# Altium schematic sheet MCU.SchDoc: SMART_HOME
size A3; DrawnBy: Le Viet Trong; SheetNumber: 4; SheetTotal: 5
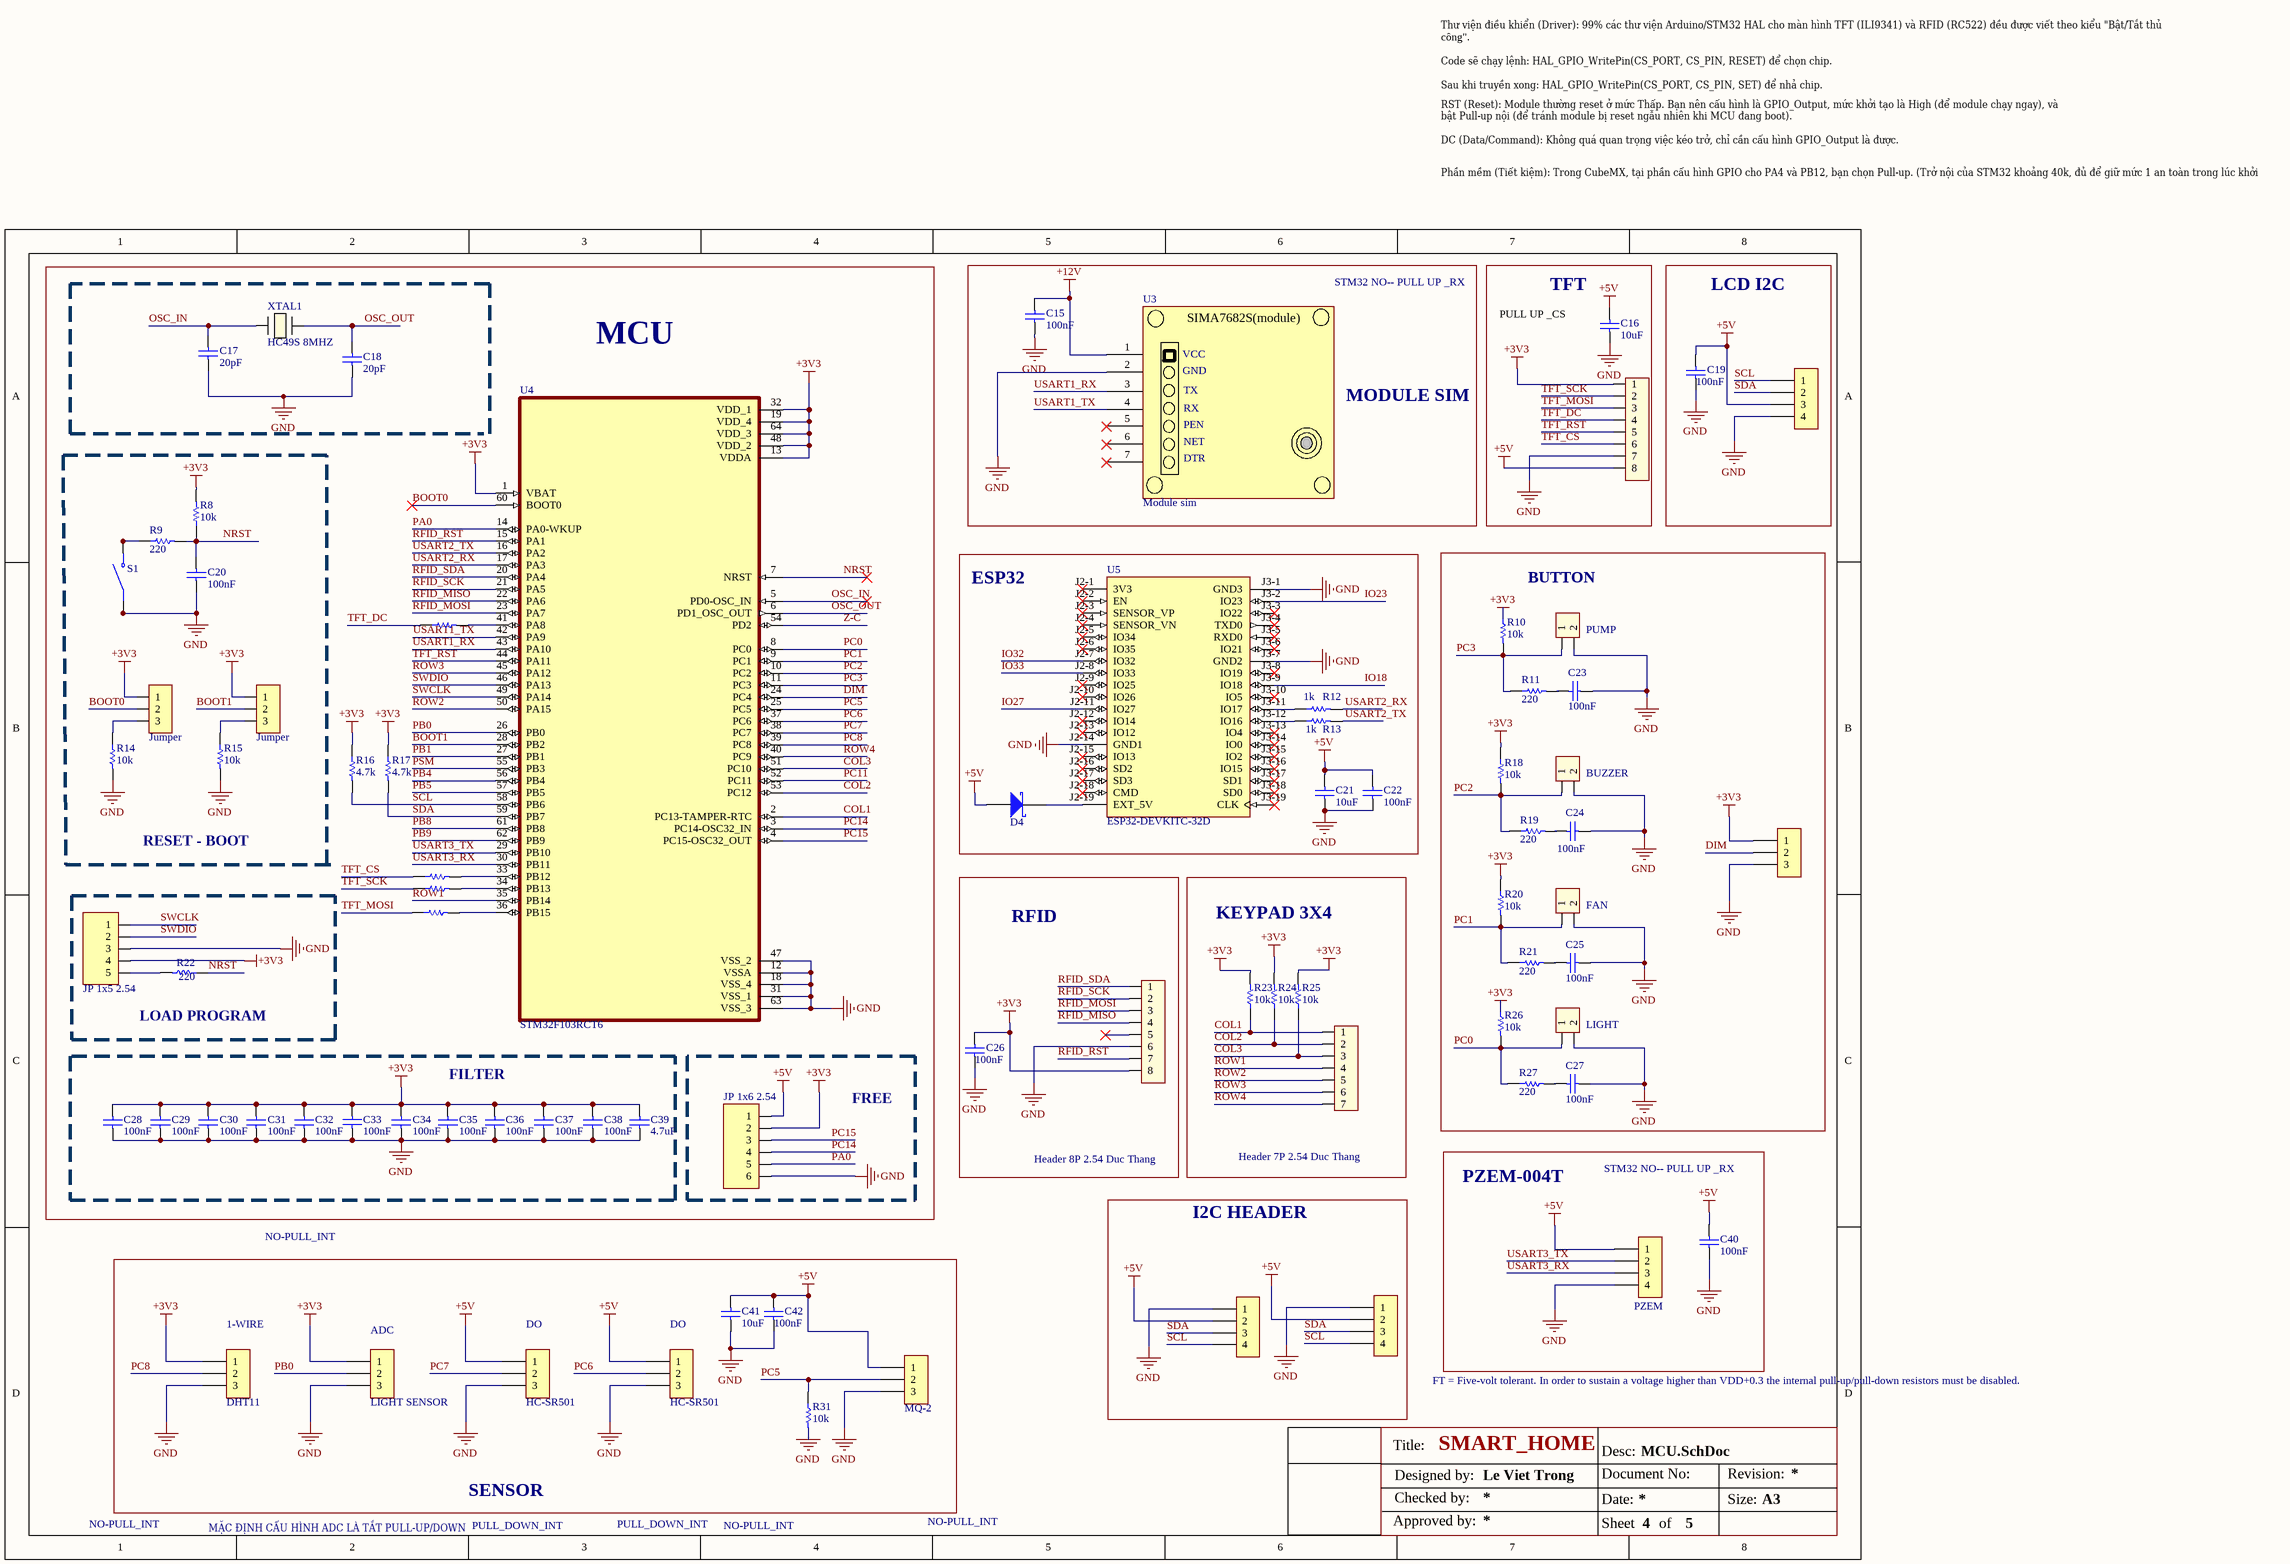
[diagram p0: MCU.SchDoc]

## Parts
C15  100nF  [CAP_0603]
C16  10uF  [CAP_0603]
C17  20pF  [CAP_0603]
C18  20pF  [CAP_0603]
C19  100nF  [CAP_0603]
C20  100nF  [CAP_0603]
C21  10uF  [CAP_0603]
C22  100nF  [CAP_0603]
C23  100nF  [CAP_0603]
C24  100nF  [CAP_0603]
C25  100nF  [CAP_0603]
C26  100nF  [CAP_0603]
C27  100nF  [CAP_0603]
C28  100nF  [CAP_0603]
C29  100nF  [CAP_0603]
C30  100nF  [CAP_0603]
C31  100nF  [CAP_0603]
C32  100nF  [CAP_0603]
C33  100nF  [CAP_0603]
C34  100nF  [CAP_0603]
C35  100nF  [CAP_0603]
C36  100nF  [CAP_0603]
C37  100nF  [CAP_0603]
C38  100nF  [CAP_0603]
C39  4.7uF  [CAP_0603]
C40  100nF  [CAP_0603]
C41  10uF  [CAP_0603]
C42  100nF  [CAP_0603]
D4  D Schottky  [SS34]  (value not drawn)
H1  Header 4P 2.54 Duc Thang  [XH2.54M-4]  (value not drawn)
H2  Header 8P 2.54 Duc Thang  [XH2.54M-8]  (value not drawn)
H3  PUMP  [XH2.54M-2]
H4  BUZZER  [XH2.54M-2]
H5  (no value)  [XH2.54M-3]
H6  FAN  [XH2.54M-2]
H7  Header 8P 2.54 Duc Thang  [XH2.54M-8]
H8  Header 7P 2.54 Duc Thang  [XH2.54M-7]
H9  LIGHT  [XH2.54M-2]
H10  PZEM  [XH2.54M-4]
H11  Header 4P 2.54 Duc Thang  [XH2.54M-4]  (value not drawn)
H12  Header 4P 2.54 Duc Thang  [XH2.54M-4]  (value not drawn)
H13  DHT11  [XH2.54M-3]
H14  LIGHT SENSOR  [XH2.54M-3]
H15  HC-SR501  [XH2.54M-3]
H16  HC-SR501  [XH2.54M-3]
H17  MQ-2  [XH2.54M-3]
JP1  Jumper  [JP 1x3 DT]
JP2  Jumper  [JP 1x3 DT]
JP3  JP 1x5 2.54  [JP 1X5 DT]
JP4  JP 1x6 2.54  [JP 1x6 DT]
R1  22  [resistor_0603]  (value not drawn)
R8  10k  [resistor_0603]
R9  220  [resistor_0603]
R10  10k  [resistor_0603]
R11  220  [resistor_0603]
R12  1k  [resistor_0603]
R13  1k  [resistor_0603]
R14  10k  [resistor_0603]
R15  10k  [resistor_0603]
R16  4.7k  [resistor_0603]
R17  4.7k  [resistor_0603]
R18  10k  [resistor_0603]
R19  220  [resistor_0603]
R20  10k  [resistor_0603]
R21  220  [resistor_0603]
R22  220  [resistor_0603]
R23  10k  [resistor_0603]
R24  10k  [resistor_0603]
R25  10k  [resistor_0603]
R26  10k  [resistor_0603]
R27  220  [resistor_0603]
R31  10k  [resistor_0603]
R43  22  [resistor_0603]  (value not drawn)
R44  22  [resistor_0603]  (value not drawn)
R45  22  [resistor_0603]  (value not drawn)
S1  Button SMD  [BUTTON]  (value not drawn)
U3  Module sim  [MODULESIM_NEW]
U4  STM32F103RCT6  [QFP50P1200X1200X160-64N]
U5  ESP32-DEVKITC-32D  [MODULE_ESP32-DEVKITC-32D]
XTAL1  HC49S 8MHZ  [XTAL_HC49S_MTC]

## Blocks framed on the sheet
MCU: C17 C18 R1 R16 R17 R43-R45 U4 XTAL1
MODULE SIM: C15 U3
TFT: C16 H2
LCD I2C: C19 H1
RESET - BOOT: C20 JP1 JP2 R8 R9 R14 R15 S1
ESP32: C21 C22 D4 R12 R13 U5
BUTTON: C23-C25 C27 H3-H6 H9 R10 R11 R18-R21 R26 R27
LOAD PROGRAM: JP3 R22
RFID: C26 H7
KEYPAD 3X4: H8 R23-R25
FILTER: C28-C39
FREE: JP4
I2C HEADER: H11 H12
PZEM-004T: C40 H10
SENSOR: C41 C42 H13-H17 R31

## Nets
+3V3: C26.2 C28.2 C29.2 C30.2 C31.2 C32.2 C33.1 C34.2 C35.2 C36.2 C37.2 C38.2 C39.2 H2.1 H5.1 H7.8 H13.1 H14.1 JP1.1 JP2.1 JP3.4 JP4.2 R8.2 R10.1 R16.1 R17.1 R18.1 R20.1 R23.2 R24.2 R25.2 R26.1 U4.1(VBAT) U4.13(VDDA) U4.19(VDD_4) U4.32(VDD_1) U4.48(VDD_2) U4.64(VDD_3)
+5V: C16.2 C19.2 C21.2 C22.2 C40.2 C41.2 C42.2 D4.1(A) H1.3 H2.8 H10.1 H11.2 H12.2 H15.1 H16.1 H17.1 JP4.1
+12V: C15.2 U3.1(VCC)
GND: C15.1 C16.1 C17.1 C18.1 C19.1 C20.1 C21.1 C22.1 C23.2 C24.2 C25.2 C26.1 C27.2 C28.1 C29.1 C30.1 C31.1 C32.1 C33.2 C34.1 C35.1 C36.1 C37.1 C38.1 C39.1 C40.1 C41.1 C42.1 H1.4 H2.7 H3.2 H4.2 H5.3 H6.2 H7.6 H9.2 H10.4 H11.1 H12.1 H13.3 H14.3 H15.3 H16.3 H17.3 JP3.3 JP4.6 R14.2 R15.2 R31.2 S1.1(COM) S1.2(COM) U3.2(GND) U4.12(VSSA) U4.18(VSS_4) U4.31(VSS_1) U4.47(VSS_2) U4.63(VSS_3) U5.J2-14(GND1) U5.J3-1(GND3) U5.J3-7(GND2)
BOOT0: JP1.2 U4.60(BOOT0)
BOOT1: JP2.2 U4.28(PB2)
COL1: H8.1 R23.1 U4.2(PC13-TAMPER-RTC)
COL2: H8.2 R24.1 U4.53(PC12)
COL3: H8.3 R25.1 U4.51(PC10)
DIM: H5.2 U4.24(PC4)
IO18: U5.J3-9(IO18)
IO23: U5.J3-2(IO23)
IO27: U5.J2-11(IO27)
IO32: U5.J2-7(IO32)
IO33: U5.J2-8(IO33)
NRST: C20.2 R8.1 R9.2 R22.1 U4.7(NRST)
OSC_IN: C17.2 U4.5(PD0-OSC_IN) XTAL1.1
OSC_OUT: C18.2 U4.6(PD1_OSC_OUT) XTAL1.2
PA0: JP4.5 U4.14(PA0-WKUP)
PB0: H14.2 U4.26(PB0)
PB1: U4.27(PB1)
PB4: U4.56(PB4)
PB5: U4.57(PB5)
PB8: U4.61(PB8)
PB9: U4.62(PB9)
PC0: H9.1 R26.2 R27.1 U4.8(PC0)
PC1: H6.1 R20.2 R21.1 U4.9(PC1)
PC2: H4.1 R18.2 R19.1 U4.10(PC2)
PC3: H3.1 R10.2 R11.1 U4.11(PC3)
PC5: H17.2 R31.1 U4.25(PC5)
PC6: H16.2 U4.37(PC6)
PC7: H15.2 U4.38(PC7)
PC8: H13.2 U4.39(PC8)
PC11: U4.52(PC11)
PC14: JP4.4 U4.3(PC14-OSC32_IN)
PC15: JP4.3 U4.4(PC15-OSC32_OUT)
PSM: U4.55(PB3)
RFID_MISO: H7.4 U4.22(PA6)
RFID_MOSI: H7.3 U4.23(PA7)
RFID_RST: H7.7 U4.15(PA1)
RFID_SCK: H7.2 U4.21(PA5)
RFID_SDA: H7.1 U4.20(PA4)
ROW1: H8.4 U4.35(PB14)
ROW2: H8.5 U4.50(PA15)
ROW3: H8.6 U4.45(PA12)
ROW4: H8.7 U4.40(PC9)
SCL: H1.1 H11.4 H12.4 R16.2 U4.58(PB6)
SDA: H1.2 H11.3 H12.3 R17.2 U4.59(PB7)
SWCLK: JP3.1 U4.49(PA14)
SWDIO: JP3.2 U4.46(PA13)
TFT_CS: H2.6 R43.1
TFT_DC: H2.4 R1.1
TFT_MOSI: H2.3 R45.1
TFT_RST: H2.5 U4.44(PA11)
TFT_SCK: H2.2 R44.1
USART1_RX: U3.3(TX) U4.43(PA10)
USART1_TX: U3.4(RX) U4.42(PA9)
USART2_RX: R12.2 U4.17(PA3)
USART2_TX: R13.2 U4.16(PA2)
USART3_RX: H10.3 U4.30(PB11)
USART3_TX: H10.2 U4.29(PB10)
Z-C: U4.54(PD2)
NetC23_1: C23.1 R11.2
NetC24_1: C24.1 R19.2
NetC25_1: C25.1 R21.2
NetC27_1: C27.1 R27.2
NetD4_2: D4.2(K) U5.J2-19(EXT_5V)
NetJP1_3: JP1.3 R14.1
NetJP2_3: JP2.3 R15.1
NetJP3_5: JP3.5 R22.2
NetR1_2: R1.2 U4.41(PA8)
NetR9_1: R9.1 S1.3(NO) S1.4(NO)
NetR12_1: R12.1 U5.J3-11(IO17)
NetR13_1: R13.1 U5.J3-12(IO16)
NetR43_2: R43.2 U4.33(PB12)
NetR44_2: R44.2 U4.34(PB13)
NetR45_2: R45.2 U4.36(PB15)

Not connected (* = marked no-connect by the designer): H7 5*; U3 5(PEN)* 6(NET)* 7(DTR)*; U5 J2-1(3V3)* J2-2(EN)* J2-3(SENSOR_VP)* J2-4(SENSOR_VN)* J2-5(IO34)* J2-6(IO35)* J2-9(IO25)* J2-10(IO26)* J2-12(IO14)* J2-13(IO12)* J2-15(IO13)* J2-16(SD2)* J2-17(SD3)* J2-18(CMD)* J3-3(IO22)* J3-4(TXD0)* J3-5(RXD0)* J3-6(IO21)* J3-8(IO19)* J3-10(IO5)* J3-13(IO4)* J3-14(IO0)* J3-15(IO2)* J3-16(IO15)* J3-17(SD1)* J3-18(SD0)* J3-19(CLK)*

## Notes on the sheet
- Thư viện điều khiển (Driver): 99% các thư viện Arduino/STM32 HAL cho màn hình TFT (ILI9341) và RFID (RC522) đều được viết theo kiểu "Bật/Tắt thủ công".
  Code sẽ chạy lệnh: HAL_GPIO_WritePin(CS_PORT, CS_PIN, RESET) để chọn chip.
  Sau khi truyền xong: HAL_GPIO_WritePin(CS_PORT, CS_PIN, SET) để nhả chip.
  Tính linh hoạt: Hardware NSS của STM32 hoạt động khá cứng nhắc (ví dụ: nó có thể tự động ngắt CS giữa các byte truyền nếu không cấu hình đúng), điều này có thể làm ngắt quãng quá trình truyền dữ liệu liên tục (Burst Mode) mà màn hình TFT cần để vẽ nhanh.
  Cấu hình: Trong CubeMX, bạn chỉ cần set chân PA4 và PB12 là GPIO_Output. Đừng chọn chức năng SPI1_NSS hay SPI2_NSS.
- RST (Reset): Module thường reset ở mức Thấp. Bạn nên cấu hình là GPIO_Output, mức khởi tạo là High (để module chạy ngay), và bật Pull-up nội (để tránh module bị reset ngẫu nhiên khi MCU đang boot).
  DC (Data/Command): Không quá quan trọng việc kéo trở, chỉ cần cấu hình GPIO_Output là được.
- Phần mềm (Tiết kiệm): Trong CubeMX, tại phần cấu hình GPIO cho PA4 và PB12, bạn chọn Pull-up. (Trở nội của STM32 khoảng 40k, đủ để giữ mức 1 an toàn trong lúc khởi động).
- STM32 NO-- PULL UP _RX
- (near C16) PULL UP _CS
- NO-PULL_INT
- (near H13) 1-WIRE
- (near H14) ADC
- (near H15) DO
- (near H16) DO
- FT = Five-volt tolerant. In order to sustain a voltage higher than VDD+0.3 the internal pull-up/pull-down resistors must be disabled.
- MẶC ĐỊNH CẤU HÌNH ADC LÀ TẮT PULL-UP/DOWN
- PULL_DOWN_INT
- Title:
- Desc:
- Designed by:
- Checked by:
- Date:
- Document No:
- Revision:
- Size:
- A3
- Approved by:
- Sheet
- of
- (in symbol Module_A7682S_V2) SIMA7682S(module)

## Library data of the parts
C15 C19 C20 C22-C38 C40 C42 = 01060310410: CAP, size 0603, 100nF; Supply 1 SN: 885012206095; Supply 1 name: Wurth Elektronik; Supply 2 name: Thegioiic; Capacitance Tolerance: +/-10%; ComponentLink1Description: Manufacturer; ComponentLink1URL: http://www.we-online.de; ComponentLink2Description: Datasheet; ComponentLink2URL: https://www.we-online.com/catalog/datasheet/885012206095.pdf; Operating Temperature: -55 to +125degC; Packaging: Tape and Reel; Supply 1 URL: https://www.we-online.com/en/components/products/WCAP-CSGP-50VDC?sq=885012206095R#885012206095R; Supply 2 SN: *; Supply 2 URL: https://www.thegioiic.com/tu-gom-0603-100nf-0-1uf-50v; Dissipation Factor: *; Height: *; Mounting Technology: SMT; Size: 0603; Capacitance: 100nF; Technical Reference: *
C16 C21 C41 = 01060310010: CAP, size 0603,10uF; Supply 2 name: Thegioiic; Capacitance Tolerance: +/-10%; ComponentLink1Description: Manufacturer; ComponentLink1URL: *; ComponentLink2Description: Datasheet; ComponentLink2URL: *; Operating Temperature: -55 to +125degC; Packaging: Tape and Reel; Supply 1 SN: *; Supply 1 name: *; Supply 1 URL: *; Supply 2 SN: *; Supply 2 URL: https://www.thegioiic.com/tu-gom-0603-10uf-16v; Dissipation Factor: *; Height: *; Mounting Technology: SMT; Size: 0603; Capacitance: 10uF; Technical Reference: *
C17 C18 = 01060322010: CAP, size 0603, 22pF; Supply 2 name: Thegioiic; Capacitance Tolerance: +/-10%; ComponentLink1Description: Manufacturer; ComponentLink1URL: Thegioiic; ComponentLink2Description: Datasheet; ComponentLink2URL: *; Operating Temperature: -55 to +125degC; Packaging: Tape and Reel; Supply 1 SN: *; Supply 1 name: *; Supply 1 URL: *; Supply 2 SN: *; Supply 2 URL: https://www.thegioiic.com/tu-gom-0603-22pf-50v; *: *; Height: *; Mounting Technology: SMT; Size: 0603; Capacitance: 22pF; Technical Reference: *
C39 = 01060310510: CAP, size 0603, 1uF; Supply 1 SN: 885012206126; Supply 1 name: Wurth Elektronik; Supply 2 name: Thegioiic; Capacitance Tolerance: +/-10%; ComponentLink1Description: Manufacturer; ComponentLink1URL: http://www.we-online.de; ComponentLink2Description: Datasheet; ComponentLink2URL: https://www.we-online.com/components/products/datasheet/885012206126.pdf; Operating Temperature: -55 to +125degC; Packaging: Tape and Reel; Supply 1 URL: https://www.we-online.com/en/components/products/WCAP-CSGP-50VDC?sq=885012206126#885012206126; Supply 2 SN: *; Supply 2 URL: https://www.thegioiic.com/tu-gom-0603-1uf-50v; Dissipation Factor: *; Height: *; Mounting Technology: SMT; Size: 0603; Capacitance: 1uF; Technical Reference: *
D4 = D Schottky: SS34; Published: 8-Jun-2000; LatestRevisionDate: 17-Jul-2002; LatestRevisionNote: Re-released for DXP Platform.; PackageReference: SMB; Publisher: Altium Limited; PackageDescription: DO-214-AA/SMB; 2 C-Bend Leads; Body 5.3 x 3.6 mm, inc. leads (LxW); Code_JEDEC: DO-214-AA
H1 H10-H12 = Header 4P 2.54 Duc Thang: Cắm; Ten_Linh_Kien: Header 4P XH2.54-4P Đực Thẳng; Don_Vi: Con; Ma_Hang: MH001285; Chung_Loai: Cắm
H2 H7 = Header 8P 2.54 Duc Thang: Cắm; Ten_Linh_Kien: Header 8P XH2.54-8P Đực Thẳng; Don_Vi: Con; Ma_Hang: MH003366; Chung_Loai: Cắm
H3 = Header 2P 2.54 Duc Thang: Header 2P 2.54; Ten_Linh_Kien: Header 2P XH2.54-2P Đực Thẳng; Don_Vi: Con; Ma_Hang: MH001283; Chung_Loai: Cắm
H4 H6 H9 = Header 2P 2.54 Duc Thang: Cắm; Ten_Linh_Kien: Header 2P XH2.54-2P Đực Thẳng; Don_Vi: Con; Ma_Hang: MH001283; Chung_Loai: Cắm
H5 H13-H17 = Header 3P 2.54 Duc Thang: Cắm; Ten_Linh_Kien: Header 3P XH2.54-3P Đực Thẳng; Don_Vi: Con; Ma_Hang: MH001292; Chung_Loai: Cắm
H8 = Header 7P 2.54 Duc Thang: Cắm; Ten_Linh_Kien: Header 7P XH2.54-7P Đực Thẳng; Don_Vi: Con; Ma_Hang: MH003369; Chung_Loai: Cắm
JP1 JP2 = JP 1x3 2.54 Duc Thang: Cắm; Ten_Linh_Kien: Jump Đơn Đực 2.54MM 1x40P Thẳng 11MM; Don_Vi: Con; Ma_Hang: MH000903; Ghi_Chu: *; Kieu_Chan: *; Chung_Loai: Cắm
JP3 = JP 1x5 2.54 Duc Cong: Cắm; Ten_Linh_Kien: Jump Đơn Đực 2.54MM 1x40P Cong Đứng; Don_Vi: Con; Ma_Hang: MH000904; Ghi_Chu: *; Kieu_Chan: *; Chung_Loai: Cắm
JP4 = JP 1x6 2.54 Duc Thang: Cắm; Ten_Linh_Kien: Jump Đơn Đực 2.54MM 1x40P Thẳng 11MM; Don_Vi: Con; Ma_Hang: MH000903; Ghi_Chu: *; Kieu_Chan: *; Chung_Loai: Cắm
R1 R43-R45 = 0006031031: RES, 22 Ohm, size 0603, 1%; Resistance: 10k; Resistance Tolerant: +/-1%; Rated Power: 1/4W; Supply 1 Name: Mouser; Supply 1 SN: 755-ESR03EZPF1002; Supply 2 Name: Digikey; Supply 2 SN: RHM10KADTR-ND RHM10KADCT-ND RHM10KADDKR-ND; Size: 0603; Mounting Technology: SMT; ComponentLink1Description: Datasheet link; ComponentLink1URL: https://fscdn.rohm.com/en/products/databook/datasheet/passive/resistor/chip_resistor/esr-e.pdf; ComponentLink2Description: Supply 1 URL; ComponentLink2URL: https://www.mouser.vn/ProductDetail/ROHM-Semiconductor/ESR03EZPF1002?qs=sGAEpiMZZMvdGkrng054t67Efho1F8r6CDeAsqwFse8%3D; ComponentLink3Description: Supply 2 URL; ComponentLink3URL: https://www.digikey.com/en/products/detail/rohm-semiconductor/ESR03EZPF1002/1983429
R8 R10 R14 R15 R18 R20 R23-R26 R31 = 0006031031: RES, 10k Ohm, size 0603, 1%; Resistance Tolerant: +/-1%; Rated Power: 1/4W; Supply 1 Name: Mouser; Supply 1 SN: 755-ESR03EZPF1002; Supply 2 Name: Digikey; Supply 2 SN: RHM10KADTR-ND RHM10KADCT-ND RHM10KADDKR-ND; Resistance: 10k; Size: 0603; Mounting Technology: SMT; ComponentLink1Description: Datasheet link; ComponentLink1URL: https://fscdn.rohm.com/en/products/databook/datasheet/passive/resistor/chip_resistor/esr-e.pdf; ComponentLink2Description: Supply 1 URL; ComponentLink2URL: https://www.mouser.vn/ProductDetail/ROHM-Semiconductor/ESR03EZPF1002?qs=sGAEpiMZZMvdGkrng054t67Efho1F8r6CDeAsqwFse8%3D; ComponentLink3Description: Supply 2 URL; ComponentLink3URL: https://www.digikey.com/en/products/detail/rohm-semiconductor/ESR03EZPF1002/1983429
R9 R11 R19 R21 R27 = 0006031031: RES, 220 Ohm, size 0603, 1%; Resistance: 10k; Resistance Tolerant: +/-1%; Rated Power: 1/4W; Supply 1 Name: Mouser; Supply 1 SN: 755-ESR03EZPF1002; Supply 2 Name: Digikey; Supply 2 SN: RHM10KADTR-ND RHM10KADCT-ND RHM10KADDKR-ND; Size: 0603; Mounting Technology: SMT; ComponentLink1Description: Datasheet link; ComponentLink1URL: https://fscdn.rohm.com/en/products/databook/datasheet/passive/resistor/chip_resistor/esr-e.pdf; ComponentLink2Description: Supply 1 URL; ComponentLink2URL: https://www.mouser.vn/ProductDetail/ROHM-Semiconductor/ESR03EZPF1002?qs=sGAEpiMZZMvdGkrng054t67Efho1F8r6CDeAsqwFse8%3D; ComponentLink3Description: Supply 2 URL; ComponentLink3URL: https://www.digikey.com/en/products/detail/rohm-semiconductor/ESR03EZPF1002/1983429
R12 R13 = 0006031031: RES, 1k Ohm, size 0603, 1%; Resistance: 10k; Resistance Tolerant: +/-1%; Rated Power: 1/4W; Supply 1 Name: Mouser; Supply 1 SN: 755-ESR03EZPF1002; Supply 2 Name: Digikey; Supply 2 SN: RHM10KADTR-ND RHM10KADCT-ND RHM10KADDKR-ND; Size: 0603; Mounting Technology: SMT; ComponentLink1Description: Datasheet link; ComponentLink1URL: https://fscdn.rohm.com/en/products/databook/datasheet/passive/resistor/chip_resistor/esr-e.pdf; ComponentLink2Description: Supply 1 URL; ComponentLink2URL: https://www.mouser.vn/ProductDetail/ROHM-Semiconductor/ESR03EZPF1002?qs=sGAEpiMZZMvdGkrng054t67Efho1F8r6CDeAsqwFse8%3D; ComponentLink3Description: Supply 2 URL; ComponentLink3URL: https://www.digikey.com/en/products/detail/rohm-semiconductor/ESR03EZPF1002/1983429
R16 R17 = 0006031031: RES, 4.7k Ohm, size 0603, 1%; Resistance: 10k; Resistance Tolerant: +/-1%; Rated Power: 1/4W; Supply 1 Name: Mouser; Supply 1 SN: 755-ESR03EZPF1002; Supply 2 Name: Digikey; Supply 2 SN: RHM10KADTR-ND RHM10KADCT-ND RHM10KADDKR-ND; Size: 0603; Mounting Technology: SMT; ComponentLink1Description: Datasheet link; ComponentLink1URL: https://fscdn.rohm.com/en/products/databook/datasheet/passive/resistor/chip_resistor/esr-e.pdf; ComponentLink2Description: Supply 1 URL; ComponentLink2URL: https://www.mouser.vn/ProductDetail/ROHM-Semiconductor/ESR03EZPF1002?qs=sGAEpiMZZMvdGkrng054t67Efho1F8r6CDeAsqwFse8%3D; ComponentLink3Description: Supply 2 URL; ComponentLink3URL: https://www.digikey.com/en/products/detail/rohm-semiconductor/ESR03EZPF1002/1983429
R22 = 0006032221: RES, 330 Ohm, size 0603, 1%; Resistance: 2.2k; Resistance Tolerant: +/-1%; Rated Power: 1/4W; Supply 1 Name: Mouser; Supply 1 SN: 667-ERJ-UP3F2201V; Supply 2 Name: Digikey; Supply 2 SN: 10-ERJ-UP3F2201VTR-ND 10-ERJ-UP3F2201VCT-ND 10-ERJ-UP3F2201VDKR-ND; Supply 3 Name: thegioiic; Supply 3 SN: NA; Size: 0603; Mounting Technology: SMT; ComponentLink1Description: Datasheet link; ComponentLink1URL: https://api.pim.na.industrial.panasonic.com/file_stream/main/fileversion/4484; ComponentLink2Description: Supply 1 URL; ComponentLink2URL: https://www.mouser.vn/ProductDetail/Panasonic/ERJ-UP3F2201V?qs=sGAEpiMZZMvdGkrng054twq3eZrCFN89KeaXYJ5LTWyJgfuuVVfZrw%3D%3D; ComponentLink3Description: Supply 2 URL; ComponentLink3URL: https://www.digikey.com/en/products/detail/panasonic-electronic-components/ERJ-UP3F2201V/12092708; ComponentLink4Description: Supply 3 URL; ComponentLink4URL: https://www.thegioiic.com/dien-tro-2-2-kohm-0603-1
S1 = Button SMD: Nút Nhấn 4x4mm Cao 1.5mm 4 Chân SMD Chống Nước; MP: 8-1437565-1; Package: None; Price: None; Availability: Unavailable; Value: *
U3 = Module_A7682S_V2: Module 4G A7682S Volte Ra chân V2 TDM2431, 4.5-16V, 28×26.8×5.5mm, Mức logic I/OTTL( Serial 3.3V)
U4 = STM32F103RCT6: ARMÂ® CortexÂ®-M3 STM32F1 Microcontroller IC 32-Bit 72MHz 256KB (256K x 8) FLASH 64-LQFP (10x10); MF: STMicroelectronics; Value: *; SnapEDA_Link: https://www.snapeda.com/parts/STM32F103RCT6/STMicroelectronics/view-part/?ref=snap; MP: STM32F103RCT6; Purchase-URL: https://pricing.snapeda.com/search/part/STM32F103RCT6/?ref=eda; Check_prices: https://www.snapeda.com/parts/STM32F103RCT6/STMicroelectronics/view-part/?ref=eda; Availability: In Stock; Price: None; Package: LQFP-64 STMicroelectronics
U5 = ESP32-DEVKITC-32D: WiFi Development Tools (802.11) ESP32 General Development Kit, ESP32-WROOM-32D on the board; MF: Espressif Systems; SnapEDA_Link: https://www.snapeda.com/parts/ESP32-DEVKITC-32D/Espressif+Systems/view-part/?ref=snap; Package: None; Value: *; MP: ESP32-DEVKITC-32D; Check_prices: https://www.snapeda.com/parts/ESP32-DEVKITC-32D/Espressif+Systems/view-part/?ref=eda
XTAL1 = HC49S-12-30-50-70-30-ATF: Description; Manufacturer_Name: Multicomp; Copyright: Copyright (C) 2025 Ultra Librarian. All rights reserved.; Manufacturer_Part_Number: HC49S-12-30-50-70-30-ATF